# Altium schematic sheet LED_Indicator.SchDoc
size A4; SheetNumber: 3; SheetTotal: 10
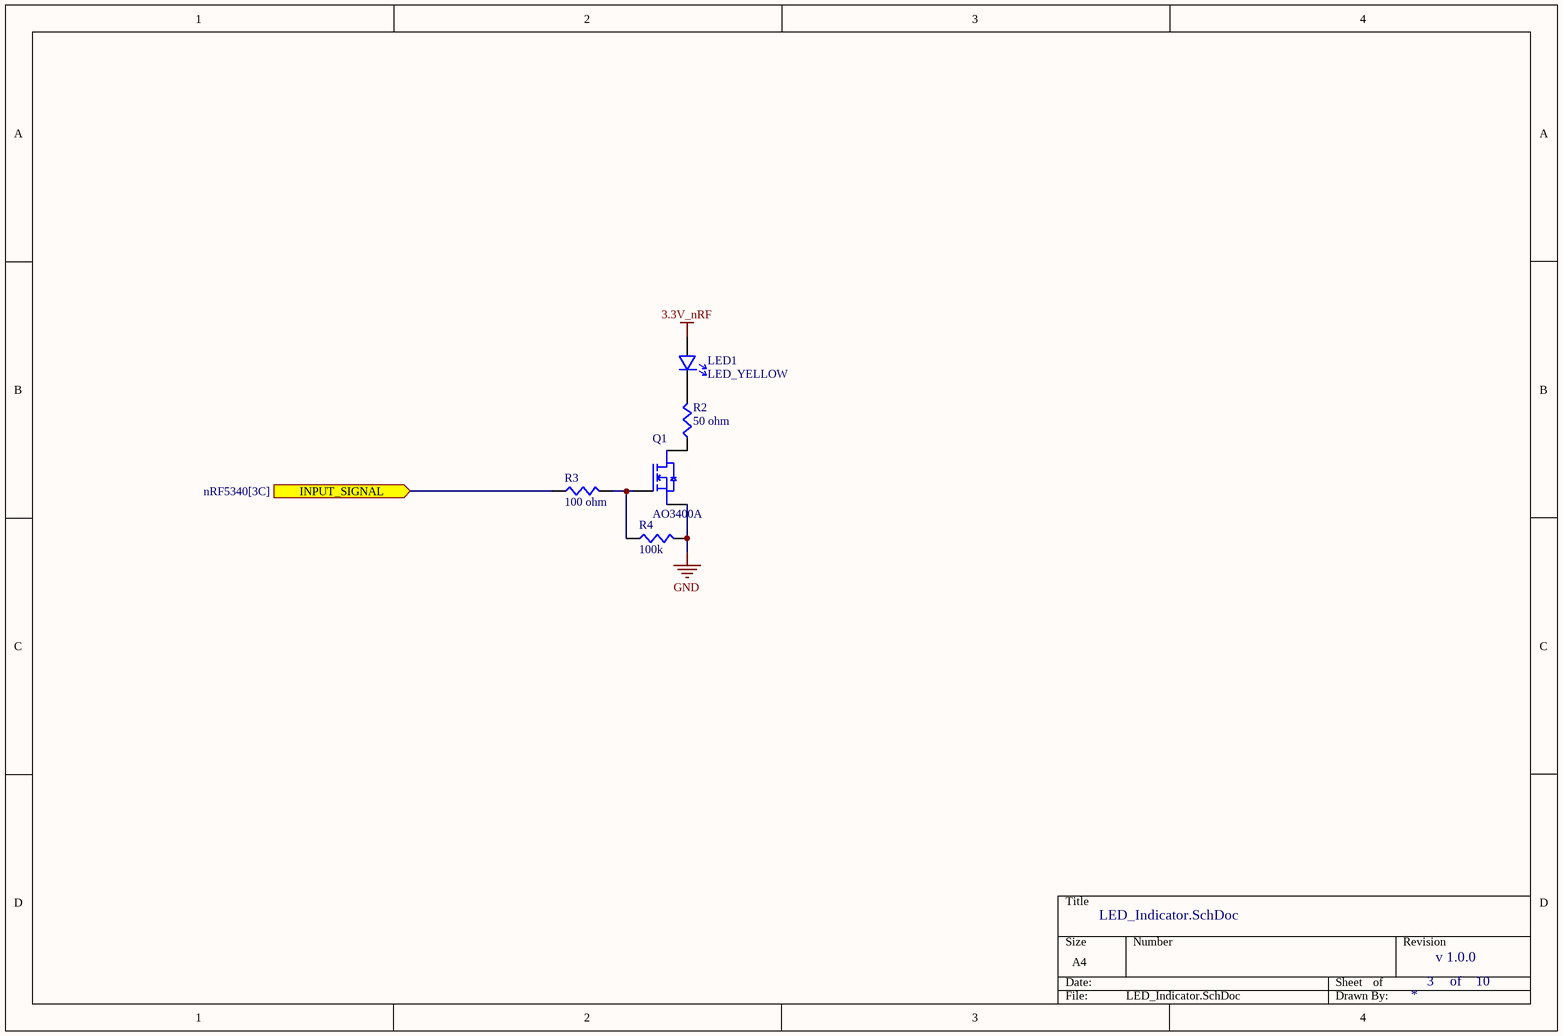
[diagram p0: LED_Indicator.SchDoc]

## Parts
LED1  LED_YELLOW  [LED_0805_127P120X200-2N]
Q1  AO3400A  [SOT23_P240X110-3N]
R2  50 ohm  [RECS0603X45N]
R3  100 ohm  [RECS0603X45N]
R4  100k  [RECS0603X45N]

## Ports
INPUT_SIGNAL (in, see nRF5340[3C])

## Nets
3.3V_nRF: LED1.2(+)
GND: Q1.2(SOURCE) R4.2
INPUT_SIGNAL: R3.1 ; port INPUT_SIGNAL
NetLED1_1: LED1.1(-) R2.2
NetQ1_1: Q1.1(GATE) R3.2 R4.1
NetQ1_3: Q1.3(DRAIN) R2.1

## Notes on the sheet
- v 1.0.0
- of

## Library data of the parts
LED1 = LED0805_YELLOW: C965814, XL-2012UYC, 120° 2.3V 20mA 50mW 585nm~595nm 590nm Discrete Diode Top-mount Water Clear Yellow 0805 LED Indication - Discrete ROHS; Supplier 1: UnikeyIC; Supplier Part Number 1: XL-2012UYC
Q1 = SOT_23_AO3400A: C347475, AO3400A, -55℃~+150℃ 1 N-channel 1.1V 1.4W 17mΩ@10V 30V 5.8A 77pF 823pF 9.7nC@4.5V 99pF SOT-23 MOSFETs ROHS; Supplier 1: UnikeyIC; Supplier Part Number 1: AO3400A
R2 = RESC0603_50_THIN: C849792, RT0603BRE0750RL, -55℃~+155℃ 100mW 50Ω 75V Thin Film Resistor ±0.1% ±50ppm/℃ 0603 Chip Resistor - Surface Mount ROHS; Supplier 1: element14 APAC; Supplier Part Number 1: RT0603BRE0750RL
R3 = RESC0603_100_THIN: C122970, RT0603BRD07100RL, -55℃~+155℃ 100mW 100Ω 75V Thin Film Resistor ±0.1% ±25ppm/℃ 0603 Chip Resistor - Surface Mount ROHS; Supplier 1: element14 APAC; Supplier Part Number 1: RT0603BRD07100RL
R4 = RESC0603_100K_THIN: C116674, AC0603FR-07100KL, -55℃~+155℃ 100kΩ 100mW 75V Thick Film Resistor ±1% ±100ppm/℃ 0603 Chip Resistor - Surface Mount ROHS; Supplier 1: element14 APAC; Supplier Part Number 1: AC0603FR-07100KL